# EAGLE design MondoBrickbridge (EAGLE 6.2)
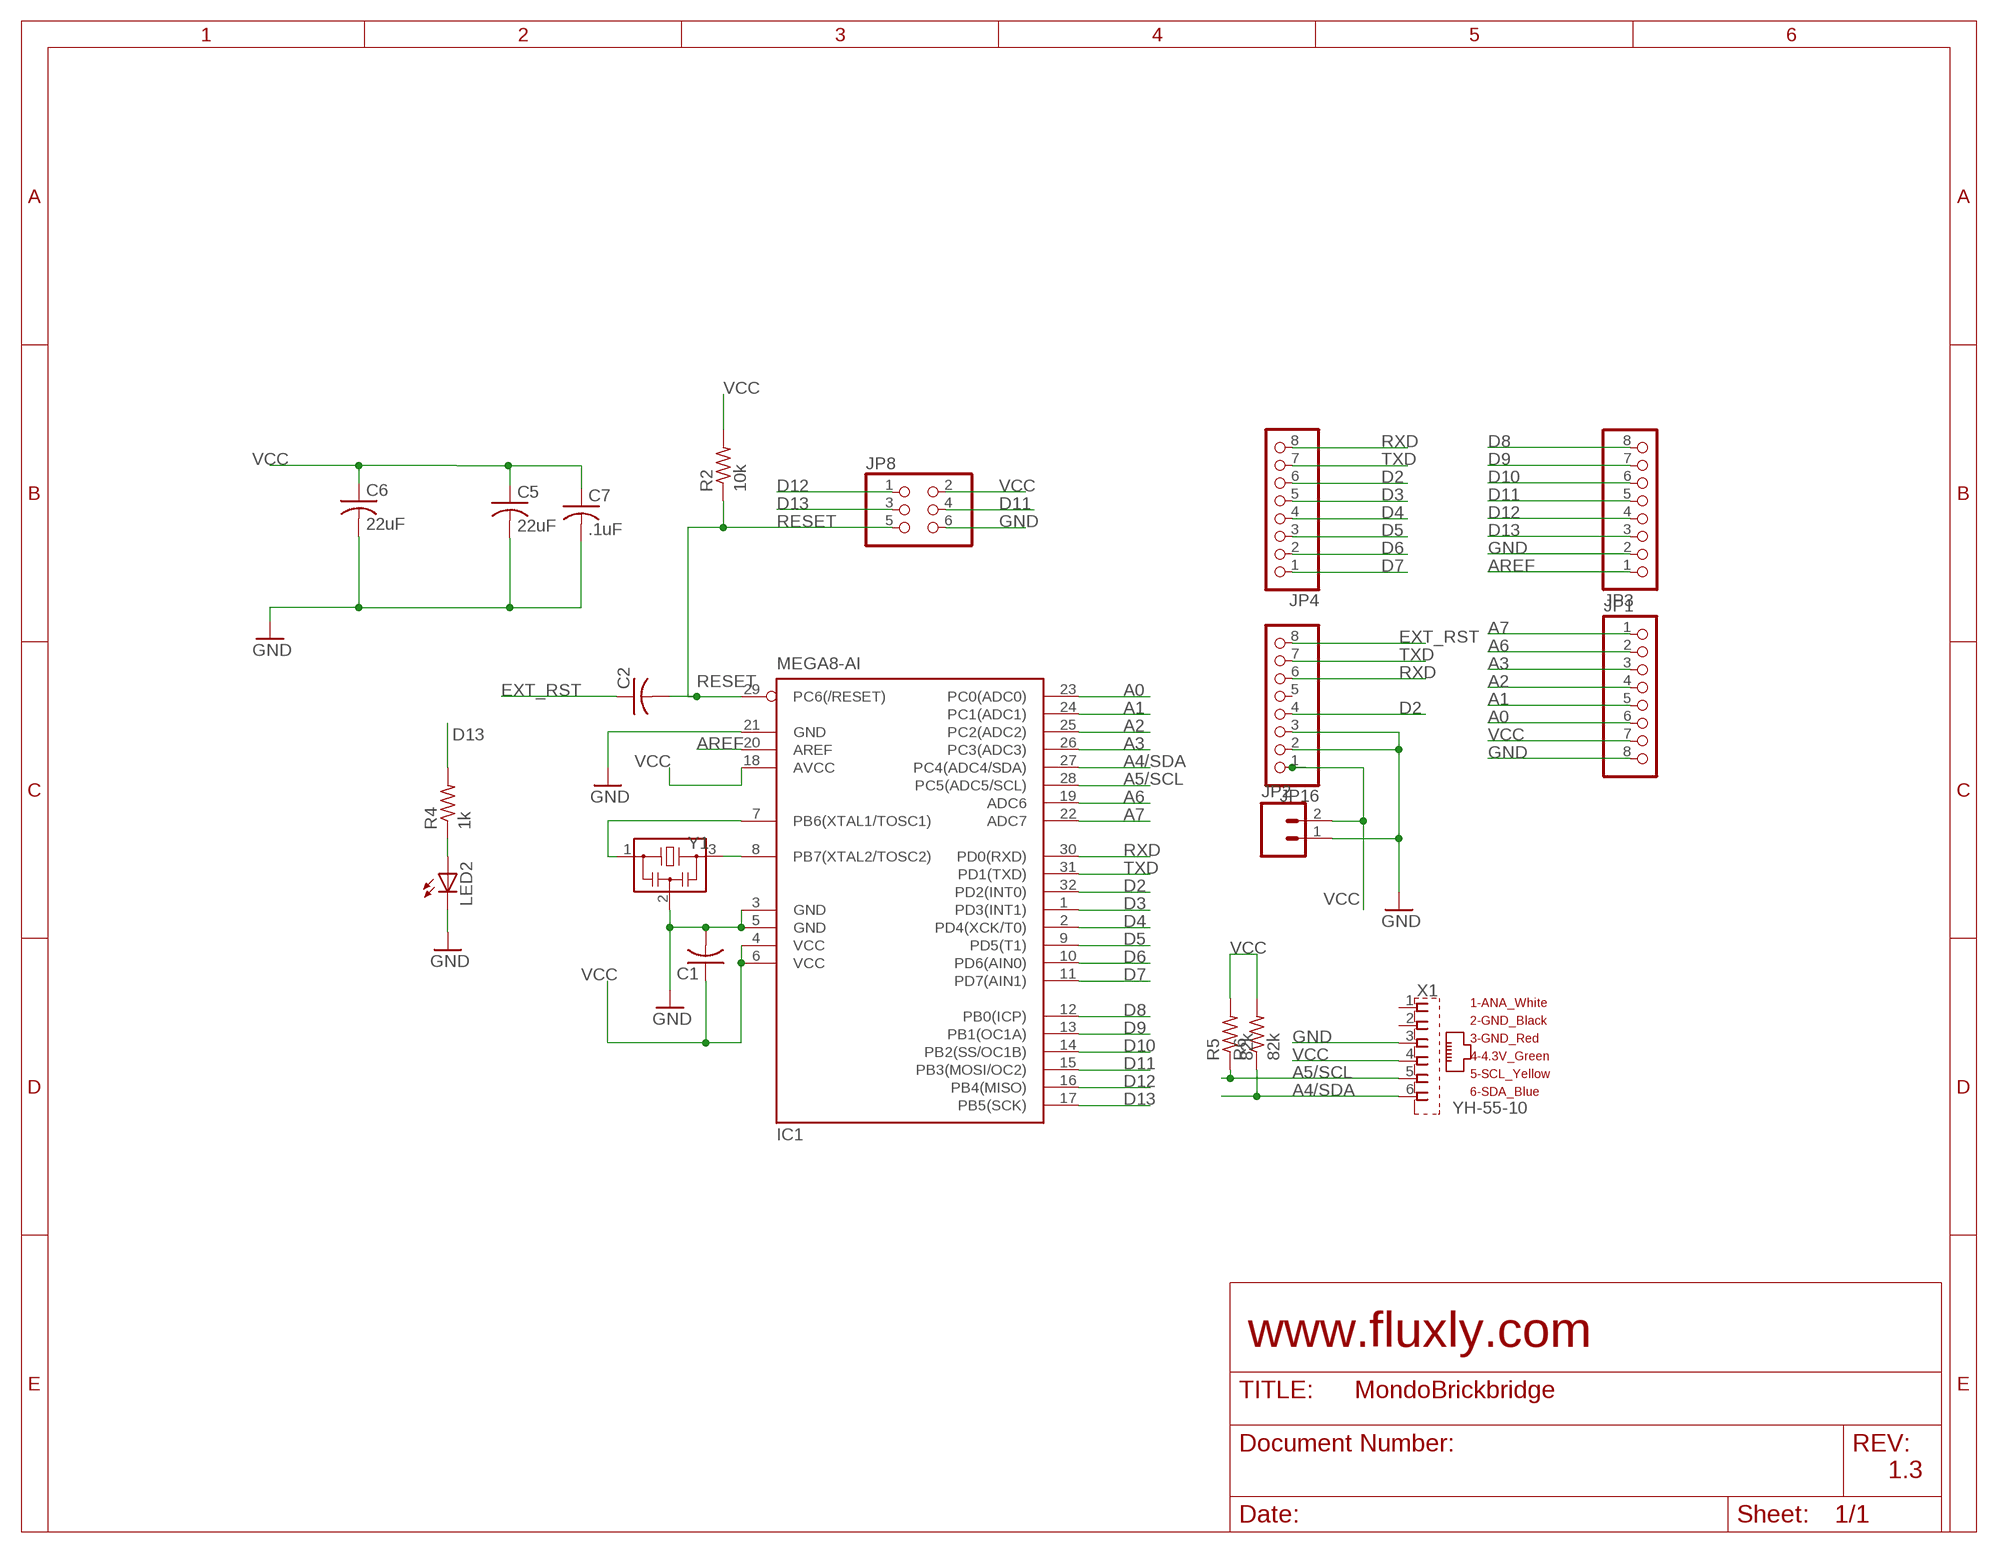
[diagram p0: schematic, sheet 1]

## Parts
C1  C-USC0805K  [C0805K]
C2  C-USC0805K  [C0805K]
C5  22uF  C-USC1206K  [C1206K]
C6  22uF  C-USC1206K  [C1206K]
C7  .1uF  C-USC0805K  [C0805K]
IC1  MEGA8-AI  [TQFP32-08]
JP1  PINHD-1X8BIG  [1X08-BIG]
JP2  M02PTH  [1X02]
JP3  PINHD-1X8BIG  [1X08-BIG]
JP4  PINHD-1X8BIG  [1X08-BIG]
JP8  PINHD-2X3  [2X03]
JP16  PINHD-1X8BIG  [1X08-BIG]
LED2  LEDCHIPLED_1206  [CHIPLED_1206]
R2  10k  R-US_M0805  [M0805]
R4  1k  R-US_M0805  [M0805]
R5  82k  R-US_M0805  [M0805]
R6  82k  R-US_M0805  [M0805]
X1  YH-55-10  [YH-55-10]
Y1  RESONATOR  [EFOBM]

## Nets
A0: IC1.23(PC0(ADC0)) JP1.6
A1: IC1.24(PC1(ADC1)) JP1.5
A2: IC1.25(PC2(ADC2)) JP1.4
A3: IC1.26(PC3(ADC3)) JP1.3
A4/SDA: IC1.27(PC4(ADC4/SDA)) R6.1 X1.6(6_SDA_BLUE)
A5/SCL: IC1.28(PC5(ADC5/SCL)) R5.1 X1.5(5_SCL_YELLOW)
A6: IC1.19(ADC6) JP1.2
A7: IC1.22(ADC7) JP1.1
AREF: IC1.20(AREF) JP3.1
D2: IC1.32(PD2(INT0)) JP4.6 JP16.4
D3: IC1.1(PD3(INT1)) JP4.5
D4: IC1.2(PD4(XCK/T0)) JP4.4
D5: IC1.9(PD5(T1)) JP4.3
D6: IC1.10(PD6(AIN0)) JP4.2
D7: IC1.11(PD7(AIN1)) JP4.1
D8: IC1.12(PB0(ICP)) JP3.8
D9: IC1.13(PB1(OC1A)) JP3.7
D10: IC1.14(PB2(SS/OC1B)) JP3.6
D11: IC1.15(PB3(MOSI/OC2)) JP3.5 JP8.4
D12: IC1.16(PB4(MISO)) JP3.4 JP8.1
D13: IC1.17(PB5(SCK)) JP3.3 JP8.3 R4.2
EXT_RST: C2.1 JP16.8
GND: C1.2 C5.2 C6.2 C7.2 IC1.3(GND) IC1.5(GND) IC1.21(GND) JP1.8 JP2.1 JP3.2 JP8.6 JP16.2 JP16.3 LED2.C X1.3(3_GND_RED) Y1.2
N$1: LED2.A R4.1
N$2: IC1.8(PB7(XTAL2/TOSC2)) Y1.3
N$3: IC1.7(PB6(XTAL1/TOSC1)) Y1.1
RESET: C2.2 IC1.29(PC6(/RESET)) JP8.5 R2.1
RXD: IC1.30(PD0(RXD)) JP4.8 JP16.6
TXD: IC1.31(PD1(TXD)) JP4.7 JP16.7
VCC: C1.1 C5.1 C6.1 C7.1 IC1.4(VCC) IC1.6(VCC) IC1.18(AVCC) JP1.7 JP2.2 JP8.2 JP16.1 R2.2 R5.2 R6.2 X1.4(4_4.3V_GREEN)
Unconnected: JP16.5 X1.1(1_ANA_WHITE) X1.2(2_GND_BLACK)

## Notes on the sheet
- www.fluxly.com
- 1.3

## Library data of the parts
C1 C2 C5-C7 = rcl:C-US: CAPACITOR, American symbol
IC1 = atmel:MEGA8: MICROCONTROLLER 8 Kbytes FLASH, 1 kbytes SRAM, 512 bytes EEPROM, USART, 6-channel 10 bit ADC, 2-channel 8 bit ADC Pin compatible with Atmega48, ATMega88, ATMega168 Source: avr.lbr; MPN: ATMEGA8-16AU; OC_FARNELL: 9171371; OC_NEWARK: 73M8863
JP1 JP3 JP4 JP16 = adafruit:PINHD-1X8: PIN HEADER
JP2 = SparkFun-Connectors:M02: Header 2 Standard 2-pin 0.1" header. Use with straight break away headers (SKU : PRT-00116), right angle break away headers (PRT-00553), swiss pins (PRT-00743), machine pins (PRT-00117), and female headers (PRT-00115). Molex polarized connector foot print use with SKU : PRT-08233 with associated crimp pins and housings.
JP8 = pinhead:PINHD-2X3: PIN HEADER
LED2 = led:LED: LED OSRAM: - CHIPLED LG R971, LG N971, LY N971, LG Q971, LY Q971, LO R971, LY R971 LH N974, LH R974 LS Q976, LO Q976, LY Q976 LO Q996 - Hyper CHIPLED LW Q18S LB Q993, LB Q99A, LB R99A - SideLED LS A670, LO A670, LY A670, LG A670, LP A670 LB A673, LV A673, LT A673, LW A673 LH A674 LY A675 LS A676, LA A676, LO A676, LY A676, LW A676 LS A679, LY A679, LG A679 - Hyper Micro SIDELED® LS Y876, LA Y876, LO Y876, LY Y876 LT Y87S - SmartLED LW L88C, LW L88S LB L89C, LB L89S, LG L890 LS L89K, LO L89K, LY L89K LS L896, LA L896, LO L896, LY L896 - TOPLED LS T670, LO T670, LY T670, LG T670, LP T670 LSG T670, LSP T670, LSY T670, LOP T670, LYG T670 LG T671, LOG T671, LSG T671 LB T673, LV T673, LT T673, LW T673 LH T674 LS T676, LA T676, LO T676, LY T676, LB T676, LH T676, LSB T676, LW T676 LB T67C, LV T67C, LT T67C, LS T67K, LO T67K, LY T67K, LW E67C LS E67B, LA E67B, LO E67B, LY E67B, LB E67C, LV E67C, LT E67C LW T67C LS T679, LY T679, LG T679 LS T770, LO T770, LY T770, LG T770, LP T770 LB T773, LV T773, LT T773, LW T773 LH T774 LS E675, LA E675, LY E675, LS T675 LS T776, LA T776, LO T776, LY T776, LB T776 LHGB T686 LT T68C, LB T68C - Hyper Mini TOPLED® LB M676 - Mini TOPLED Santana® LG M470 LS M47K, LO M47K, LY M47K Source: http://www.osram.convergy.de LUXEON: - LUMILED® LXK2-PW12-R00, LXK2-PW12-S00, LXK2-PW14-U00, LXK2-PW14-V00 LXK2-PM12-R00, LXK2-PM12-S00, LXK2-PM14-U00 LXK2-PE12-Q00, LXK2-PE12-R00, LXK2-PE12-S00, LXK2-PE14-T00, LXK2-PE14-U00 LXK2-PB12-K00, LXK2-PB12-L00, LXK2-PB12-M00, LXK2-PB14-N00, LXK2-PB14-P00, LXK2-PB14-Q00 LXK2-PR12-L00, LXK2-PR12-M00, LXK2-PR14-Q00, LXK2-PR14-R00 LXK2-PD12-Q00, LXK2-PD12-R00, LXK2-PD12-S00 LXK2-PH12-R00, LXK2-PH12-S00 LXK2-PL12-P00, LXK2-PL12-Q00, LXK2-PL12-R00 Source: www.luxeon.com KINGBRIGHT: KA-3528ASYC Source: www.kingbright.com
R2 R4-R6 = rcl:R-US_: RESISTOR, American symbol
X1 = Dexter_Industries_Eagle_Library_Female_Sockets:YH-55-10: RJ11 6 connects Source:Dexter Industries LEGO MINDSTORMS NXT Female Adapter; OC_FARNELL: unknown; OC_NEWARK: unknown
Y1 = fab:RESONATOR

## Board
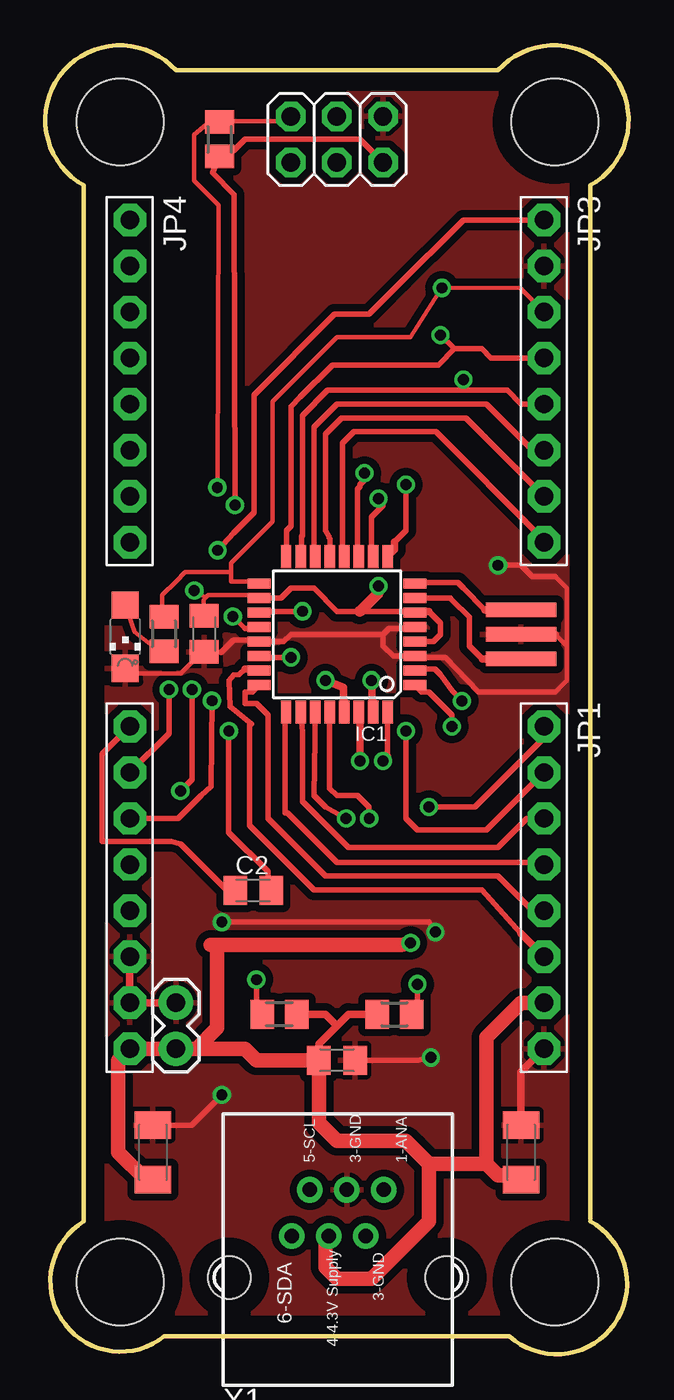
[diagram p1: board, top side]
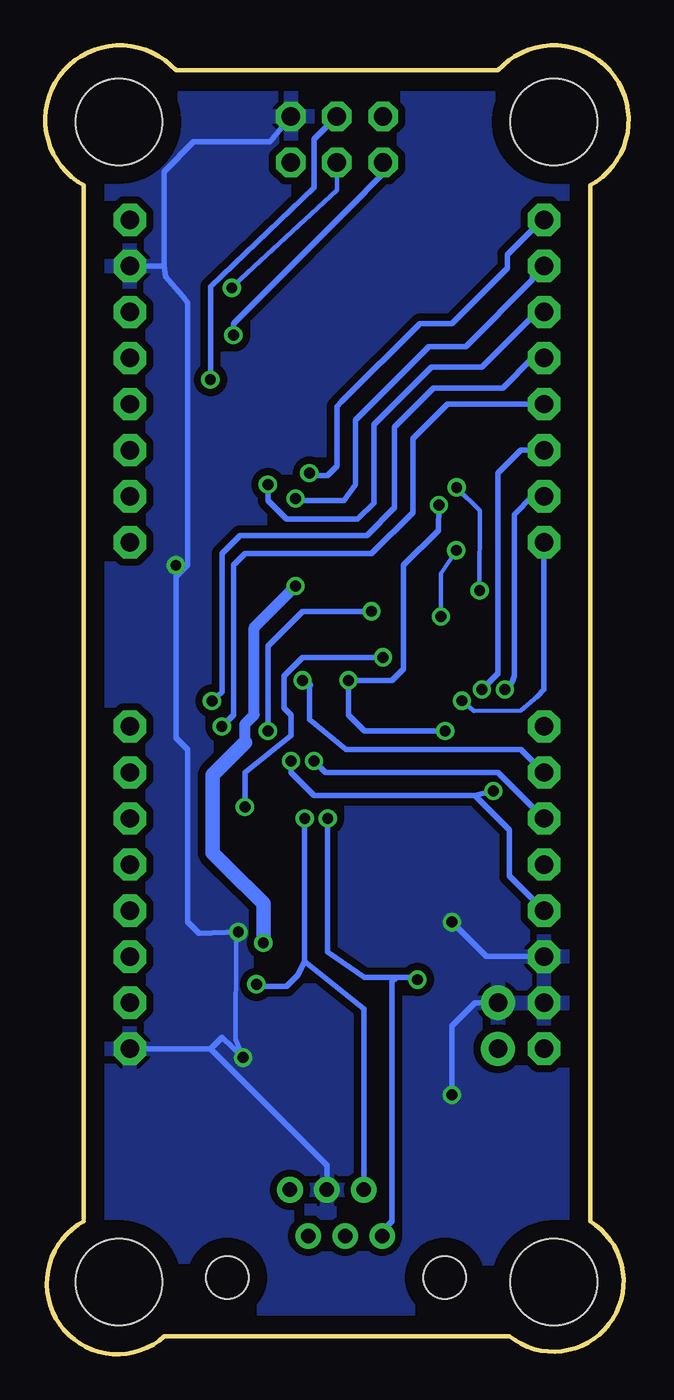
[diagram p2: board, bottom side, seen from below]

Size 32.19 x 72.21 mm. Coordinates in mm from the lower left corner, seen from the top.
Outline: 30.07,7.45 30.07,20.03 30.07,64.48 arc199 24.99,70.83 7.21,70.83 arc199 2.13,64.48 2.13,7.33 arc187 6.57,0.98 25.62,0.98 arc193 30.07,7.33
Copper layers (1*16): Top 0.035mm / dielectric 1.5mm / Bottom 0.035mm
Design rules: minimum track width 10mil, minimum drill 24mil, track to track 8mil, track to pad 8mil, pad to pad 8mil, via to via 8mil, smd to smd 8mil, copper to edge 40mil, drill to drill 8mil, minimum pad ring 12mil, minimum via ring 8mil, stop-mask expansion 4mil, vias tented up to drill 24mil, thermal gap 10mil
Holes 4.8 mm at 4.13,3.98 28.13,3.98 4.13,67.98 28.13,67.98

### Footprints (pad centres in the part's own frame; a part is rotated, then mirrored left to right if it is on the bottom)
C0805K = smd 1.3 x 1.6: 1 -1,0; 2 1,0
C1206K = smd 1.5 x 2: 1 -1.5,0; 2 1.5,0
TQFP32-08 = smd 1.27 x 0.559: 1 -4.293,2.8; 2 -4.293,2; 3 -4.293,1.2; 4 -4.293,0.4; 5 -4.293,-0.4; 6 -4.293,-1.2; 7 -4.293,-2; 8 -4.293,-2.8; 17 4.293,-2.8; 18 4.293,-2; 19 4.293,-1.2; 20 4.293,-0.4; 21 4.293,0.4; 22 4.293,1.2; 23 4.293,2; 24 4.293,2.8 | smd 0.559 x 1.27: 9 -2.8,-4.293; 10 -2,-4.293; 11 -1.2,-4.293; 12 -0.4,-4.293; 13 0.4,-4.293; 14 1.2,-4.293; 15 2,-4.293; 16 2.8,-4.293; 25 2.8,4.293; 26 2,4.293; 27 1.2,4.293; 28 0.4,4.293; 29 -0.4,4.293; 30 -1.2,4.293; 31 -2,4.293; 32 -2.8,4.293
1X08-BIG = drill 1.016 pad 1.778 octagon: 1 -8.89,0; 2 -6.35,0; 3 -3.81,0; 4 -1.27,0; 5 1.27,0; 6 3.81,0; 7 6.35,0; 8 8.89,0
1X02 = drill 1.016 pad 1.88: 1 0,0; 2 2.54,0
2X03 = drill 1.016 octagon: 1 -2.54,-1.27; 2 -2.54,1.27; 3 0,-1.27; 4 0,1.27; 5 2.54,-1.27; 6 2.54,1.27
CHIPLED_1206 = smd 1.5 x 1.5: A 0,-1.75; C 0,1.75
M0805 = smd 1.3 x 1.6: 1 -0.95,0; 2 0.95,0
YH-55-10 = drill 0.8 pad 1.3: 1 2.54,4.84; 2 1.54,2.3; 3 0.5,4.84; 4 -0.5,2.3; 5 -1.54,4.84; 6 -2.54,2.3 | hole 2.36: -6,0; 6,0
EFOBM = smd 0.8 x 3.9: 1 -1.35,0; 2 0,0; 3 1.35,0

### Placement (x,y rotation side)
C1  16.1,16.22 0 top
C2  11.48,25.58 0 top
C5  26.26,11.14 90 top
C6  5.94,11.14 90 top
C7  8.78,39.74 270 top
IC1  16.1,39.71 180 top
JP1  27.53,25.74 270 top
JP2  7.21,19.39 270 top
JP3  27.53,53.68 270 top
JP4  4.67,53.68 270 top
JP8  16.1,67.02 0 top
JP16  4.67,25.74 90 top
LED2  4.41,39.59 180 top
R2  9.62,67.02 90 top
R4  6.55,39.74 90 top
R5  19.27,18.76 180 top
R6  12.92,18.76 0 top
X1  16.15,4.23 0 top
Y1  26.26,39.71 90 top

### Tracks (layer width: path | path; a pad name or v marks a point on that pad's centre or on a via)
A0
  Top 0.305: 26.26,23.2 24.1,25.62 15.21,25.62 14.83,25.62 11.52,28.92 11.27,29.17 11.27,34.76 11.4,34.76 10.19,35.73 10.15,37.15 10.38,37.47 10.7,37.49 11.02,37.81
  Top 0.406: JP1.6 26.26,23.2 | 11.02,37.81 11.71,37.81 IC1.23
A1
  Top 0.305: JP1.5 26.89,24.47 24.99,26.38 15.46,26.38 12.29,29.55 12.29,35.27 11.65,35.9 11.02,35.9 11.02,36.54 11.43,36.54 IC1.24
A2
  Top 0.305: 13.24,35.36 13.24,34 13.24,32.41 13.24,29.87 13.37,29.87 16.1,27.14 27.4,27.14 JP1.4
  Top 0.406: 13.24,35.36 IC1.25
A3
  Top 0.305: JP1.3 26.57,29.55 24.99,27.97 16.73,27.97 14.19,30.5 14.19,33.68 14.19,34.31 14.08,35.45
  Top 0.406: 14.08,35.45 IC1.26
A4/SDA  (via drill 0.6)
  Top 0.305: IC1.27 14.9,33.93 14.83,30.82 15.46,30.19 v16.6,29.55 | v11.65,20.66 11.65,19.08 R6.1
  Bottom 0.305: v16.6,29.55 16.6,25.62 16.6,22.19 14.57,20.79 12.79,20.79 | X1.6 13.61,6.64 13.61,6.77 13.05,7.33 13.05,20.54 12.79,20.79 | 12.79,20.79 11.78,20.79 v11.65,20.66
A5/SCL  (via drill 0.6)
  Top 0.305: IC1.28 15.7,31.22 16.1,30.82 17.24,30.82 17.87,30.19 v17.87,29.55 | v20.54,20.41 20.54,19.08 R5.1
  Bottom 0.305: v17.87,29.55 17.87,21.68 | X1.5 14.61,11.55 14.61,19.05 17.87,21.68 | 17.87,21.68 18.26,20.92 18.89,20.28 20.41,20.28 v20.54,20.41
A6  (via drill 0.6)
  Top 0.305: JP1.2 24.35,28.92 20.54,28.92 19.91,29.55 v19.91,34.38 | v14.19,40.98 11.87,40.98
  Top 0.406: 11.87,40.98 IC1.19
  Bottom 0.305: v19.91,34.38 19.91,39.08 18,40.98 v14.19,40.98
A7  (via drill 0.6)
  Top 0.305: JP1.1 27.53,34 23.72,30.19 v21.18,30.19 | v13.56,38.44 11.87,38.44
  Top 0.406: 11.87,38.44 IC1.22
  Bottom 0.305: v21.18,30.19 21.18,32.09 18.64,34.12 18.64,35.27 19.02,35.65 19.02,37.43 18,38.44 v13.56,38.44
AREF  (via drill 0.6)
  Top 0.254: 11.02,40.03 v10.35,40.69 | v9.51,44.35 10.38,45.3
  Top 0.305: JP3.1 23.21,62.57 23.08,62.57 22.19,61.68 20.16,59.65 17.87,57.37 15.97,57.37 11.52,52.92 11.52,46.44 10.38,45.3 v9.51,44.35 | 11.02,40.03 11.72,40.03 IC1.20
  Bottom 0.254: v10.35,40.69 10.36,43.05 v9.51,44.35
D2  (via drill 0.6)
  Top 0.305: IC1.32 18.9,32.99 | v8.1,36.66 8.1,31.71 v7.46,31.08
  Top 0.406: 18.9,32.99 v18.64,32.73
  Bottom 0.305: v18.64,32.73 18.64,32.09 17.37,30.82 8.48,30.82 | 8.48,30.82 6.57,28.92 6.57,26.38 JP16.4 | JP4.6 5.94,49.87 7.21,48.6 7.21,43.65 7.21,42.38 7.21,37.55 v8.1,36.66 | v7.46,31.08 8.48,30.82
D3  (via drill 0.6)
  Top 0.305: v22.45,34.63 22.45,35.27 21.18,36.54 20.76,36.54 IC1.1
  Bottom 0.305: JP4.5 6.57,52.41 9.11,52.41 10,52.41 11.91,50.51 11.91,46.44 14.19,44.16 21.18,44.16 21.81,43.52 21.81,35.27 v22.45,34.63
D4  (via drill 0.6)
  Top 0.305: v23,36.03 22.47,36.59 21.81,37.49 21.49,37.81 20.48,37.81 IC1.2
  Bottom 0.305: v23,36.03 22.45,36.54 22.45,44.16 21.43,45.17 14.45,45.17 12.92,46.7 12.92,51.14 10.76,53.3 6.95,53.3 5.3,54.95 JP4.4
D5  (via drill 0.6)
  Top 0.305: v19.91,47.97 19.91,45.43 19.27,44.79
  Top 0.406: 19.27,44.79 19.27,44.38 IC1.9
  Bottom 0.305: JP4.3 4.92,57.62 8.1,54.44 10.89,54.44 14.06,51.27 14.06,46.95 14.95,46.06 18.89,46.06 19.91,47.08 v19.91,47.97
D6  (via drill 0.6)
  Top 0.305: v18.38,47.21 18.64,46.82 18,46.19 18,44.1 IC1.10
  Bottom 0.305: JP4.2 5.3,60.03 5.3,59.27 8.98,55.59 11.02,55.59 15.08,51.52 15.08,47.97 15.72,47.08 18,47.08 v18.38,47.21
D7  (via drill 0.6)
  Top 0.305: 17.37,44.08 IC1.11 17.23,44.07 17.23,47.72 17.37,47.86 17.37,47.97 17.62,48.22 v17.62,48.6
  Bottom 0.305: JP4.1 4.79,62.57 6.7,60.67 6.7,59.91 9.75,56.86 11.52,56.86 15.84,52.54 16.1,52.29 16.1,48.98 16.6,48.48 17.24,48.48 v17.62,48.6
D8
  Top 0.305: JP3.8 27.27,45.17 21.56,50.89 17.05,50.89 16.41,50.25 16.41,44.09 IC1.12
D9
  Top 0.305: JP3.7 23.21,51.65 16.48,51.65 16.35,51.65 15.46,50.76 15.46,45.43 15.65,45.11 15.65,45.05 15.73,44.98 15.73,44.03 IC1.13
D10
  Top 0.305: JP3.6 26.89,49.87 24.35,52.41 16.1,52.41 14.83,51.14 14.83,44.08
  Top 0.406: 14.83,44.08 IC1.14
D11  (via drill 0.6)
  Top 0.305: JP3.5 26.26,52.41 25.49,53.17 23.08,53.17 | 23.08,53.17 15.59,53.17 14.19,51.78 14.19,45.17 14.13,45.11 14.13,44.04 IC1.15 | v23.08,53.77 23.08,53.17
  Bottom 0.305: v23.08,53.77 23.08,58.89 17.37,64.35 17.37,67.02 JP8.4
D12  (via drill 0.6)
  Top 0.305: IC1.16 13.3,45.43 13.56,45.68 13.56,52.29 14.06,52.79 15.84,54.57 16.86,54.57 21.68,54.57 22.57,55.46 | JP3.4 24.61,54.95 24.1,55.46 22.57,55.46 | v21.81,56.22 22.57,55.46
  Bottom 0.305: JP8.1 13.56,65.11 15.46,63.21 16.73,61.94 21.81,56.86 | 21.81,56.86 21.81,56.73 | 21.81,56.73 21.81,56.86 | 21.81,56.86 21.81,56.73 | 21.81,56.73 v21.81,56.22
D13  (via drill 0.6)
  Top 0.254: IC1.17 11.27,42.63 10.25,42.63 10.25,43.14 | R4.2 6.44,41.11 6.44,41.87 7.21,42.63 7.71,43.14 10.25,43.14 | JP3.3 26.21,58.8 v21.9,58.83 20.16,56.1 16.1,56.1 12.54,52.54 12.54,45.94 10.25,43.65 10.25,43.14
  Bottom 0.254: JP8.3 16.1,64.99 16.1,64.22 21.39,59.33 v21.9,58.83
EXT_RST
  Top 0.305: C2.1 10.03,25.58 7.46,28.16 6.95,28.28 3.14,28.28 3.14,28.66 3.14,33.11 JP16.8
GND  (via drill 0.6)
  Top 0.254: 28.16,39.71 28.8,39.08 | 28.8,39.08 28.8,37.17 28.16,36.54 | 28.16,42.89 28.8,42.25 28.8,39.08 | C7.2 8.48,38.57 7.46,37.55 4.67,37.55 LED2.C
  Top 0.305: IC1.3 19.2,38.51 18.64,39.08 18.64,39.71 | 18.64,39.71 18.95,40.03 20.31,40.03 | 28.16,36.54 23.91,36.54 22.09,38.42 20.46,38.44 | 18.64,39.71 13.56,39.71 13.16,39.31 IC1.21 11.72,39.39 10.38,39.39 9.7,38.71 C7.2 | C6.2 8.07,12.64 v9.75,14.31 | C1.2 20.54,16.22 v21.28,16.37 | v9.75,23.84 21.18,23.84 v21.54,23.29 | v24.99,43.52 26.26,43.52 26.89,42.89 28.16,42.89
  Top 0.406: C5.2 26.26,15.58 JP1.8 | JP16.3 JP16.2 JP2.1 | 20.31,40.03 IC1.5 | Y1.2 28.16,39.71 | 20.46,38.44 IC1.3
  Bottom 0.254: v21.28,16.37 21.7,17.35 21.66,22.66 v21.54,23.29
  Bottom 0.305: v9.75,14.31 9.75,18.12 8.48,19.39 JP2.1 | X1.3 16.65,10.42 23.08,16.85 | 23.08,16.85 JP1.8 | v21.28,16.37 22.45,17.49 23.08,16.85 | JP16.3 7.84,21.93 v9.75,23.84 | v21.54,23.29 23.72,23.2 24.35,23.84 24.35,33.36 24.99,34 24.99,42.89 | 24.99,42.89 v24.99,43.52 | 24.99,42.89 24.35,43.52 24.35,58 24.61,58.38 25.56,59.44 25.62,60.03 | 25.62,60.03 25.62,65.24 24.02,66.88 19.78,66.89 JP8.6 | 25.62,60.03 JP3.2
  pour Bottom (isolate 0.406): -3.97,73.75 -1.68,-1.56 39.8,-1.56 41.07,73.75
  pour Top (isolate 0.406): -2.95,-0.29 -3.72,73.11 36.27,74 36.27,-0.29
N$1
  Top 0.254: LED2.A 4.92,39.84 5.94,39.08 R4.1
N$2
  Top 0.305: 24.27,41.06 23.08,42.25 22.76,42.57 20.45,42.57
  Top 0.406: Y1.3 24.27,41.06 | 20.45,42.57 IC1.8
N$3
  Top 0.305: 24.11,38.36 23.4,39.08 23.4,40.67 22.45,41.62 22.35,41.71 20.68,41.71
  Top 0.406: Y1.1 24.11,38.36 | 20.68,41.71 IC1.7
RESET  (via drill 0.6)
  Top 0.305: JP8.5 17.37,67.02 11.02,67.02 10.38,66.38 9.43,66.38 R2.1 9.24,65.18 10.42,63.97 v10.47,46.85 | v10.13,34.38 10.13,28.79 12.29,26.63 12.29,25.78 C2.2
  Top 0.406: v15.46,37.17 16.47,36.77 IC1.29
  Bottom 0.305: v10.47,46.85 10.51,45.43 12.41,43.52 12.41,37.81 13.05,37.17 v15.46,37.17 15.46,35.27 14.57,34.38 v10.13,34.38
RXD  (via drill 0.6)
  Top 0.305: v9.2,36.05 9.15,31.33 8.6,30.82 7.59,29.81 7.33,29.55 JP16.6
  Top 0.406: v17.37,32.73 17.37,35.35 IC1.30
  Bottom 0.254: 5.05,36.28 5.94,35.52 8.54,35.49 v9.2,36.05
  Bottom 0.305: JP16.6 7.21,32.09 16.73,32.09 v17.37,32.73 | JP4.8 4.67,36.66 5.05,36.28
TXD  (via drill 0.6)
  Top 0.305: v6.83,36.66 6.83,34.25 JP16.7
  Top 0.406: v18,37.17 IC1.31
  Bottom 0.305: JP16.7 5.94,33.36 15.59,33.36 17.62,35.01 17.62,36.92 | JP4.7 5.3,47.33 6.32,46.32 6.32,44.03 6.32,43.52 6.32,37.43 6.44,37.05 v6.83,36.66
  Bottom 0.406: 17.62,36.92 v18,37.17
VCC  (via drill 0.6)
  Top 0.254: IC1.18 11.27,41.87 8.98,41.87 8.86,41.74 | 8.86,41.74 8.73,41.62 8.73,41.11 C7.1 | 9.43,68.29 8.22,67.27 8.22,64.73 9.56,63.38 9.51,48.05 v9.49,47.82 | v8.22,42.13 8.86,41.74 | R2.2 10.25,68.03 13.05,68.03 JP8.2
  Top 0.305: IC1.18 13.02,41.71 13.56,42.25 14.83,42.25 16.1,40.98 17.37,40.98 20.32,40.98 | IC1.4 21.41,39.31 21.81,39.71 21.81,40.35 21.18,40.98 | 9.43,68.29 R2.2 | 18.32,22.51 18.38,22.57
  Top 0.406: C6.1 5.53,9.64 | 14.83,16.49 C1.1 15.1,17.12 16.1,18.12 | 16.1,18.12 15.46,18.76 R6.2 | 16.1,18.12 16.73,18.76 R5.2 | 26.03,9.87 C5.1 | 20.32,40.98 IC1.6 20.46,40.98 21.18,40.98
  Top 0.61: v18.38,42.38 18.38,42 17.37,40.98
  Top 0.813: 5.53,9.64 4.03,11.14 4.03,16.22 JP16.1 JP2.2 7.84,16.85 | 7.84,16.85 11.02,16.85 11.65,16.22 C1.1 15.1,12.77 16.1,11.77 19.91,11.77 21.18,10.5 | 21.18,10.5 21.18,7.33 18,4.15 16.1,4.15 15.46,4.79 15.46,6.34 X1.4 | 24.35,10.5 24.35,17.49 26.26,19.39 JP1.7 | 24.35,10.5 21.18,10.5 | 24.35,10.5 24.99,9.87 26.03,9.87 | 9.11,22.57 9.49,22.57 | 9.49,22.57 18.38,22.57 19.65,22.57 v20.16,22.69 | 7.84,16.85 8.35,16.85 9.49,18 9.49,22.57
  Bottom 0.254: v8.22,42.13 8.2,46.55 v9.49,47.82
  Bottom 0.61: 21.18,33.74 21.18,34.76 20.67,35.27 20.67,40.09 v18.38,42.38
  Bottom 0.813: v20.16,22.69 20.16,24.85 22.19,26.89 22.95,27.65 22.95,31.97 21.18,33.74

### Text on the board
_tNames: 1k | 10k | 1k | ATTINY 84/44